# Altium schematic sheet encodeur_pale.SchDoc
size A4; SheetNumber: 4; SheetTotal: 11
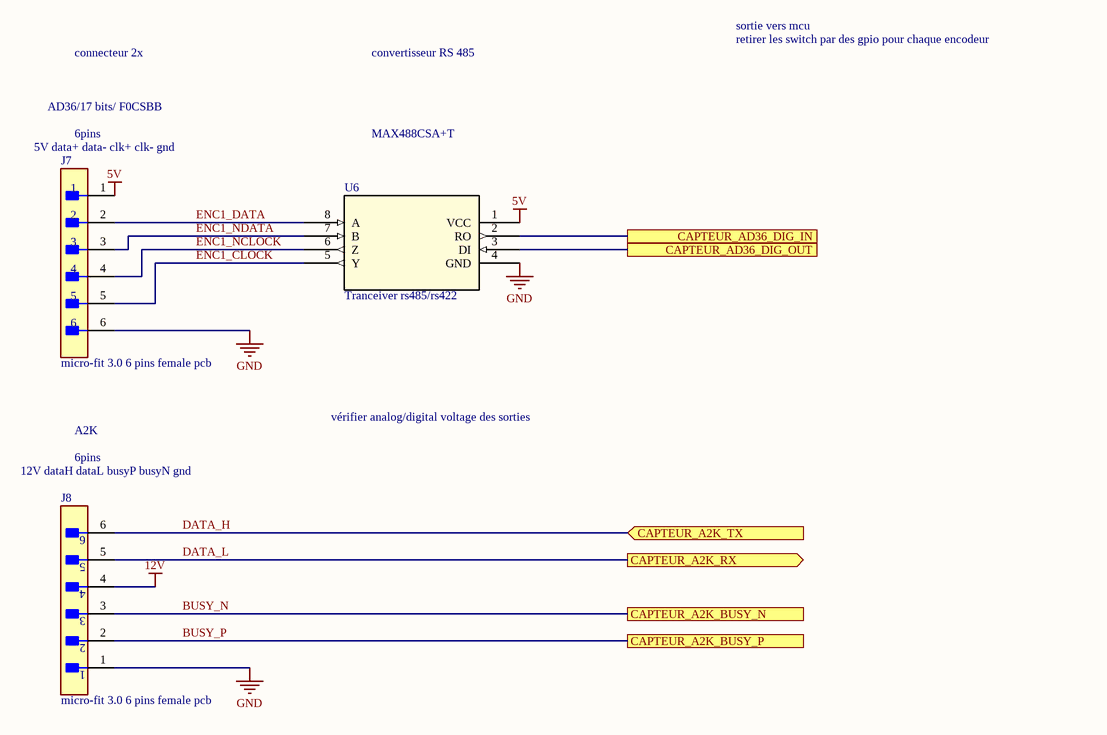
[diagram p0: encodeur_pale.SchDoc]

## Parts
J7  micro-fit 3.0 6 pins female pcb  [FP-0430450600-MFG]
J8  micro-fit 3.0 6 pins female pcb  [FP-0430450600-MFG]
U6  Tranceiver rs485/rs422  [21-0041_S8+2_MXM-M]

## Ports
CAPTEUR_A2K_BUSY_N, CAPTEUR_A2K_BUSY_P, CAPTEUR_A2K_RX (out), CAPTEUR_A2K_TX (in), CAPTEUR_AD36_DIG_IN, CAPTEUR_AD36_DIG_OUT

## Nets
5V: J7.1 U6.1(VCC)
12V: J8.4
GND: J7.6 J8.1 U6.4(GND)
BUSY_N: J8.3 ; port CAPTEUR_A2K_BUSY_N
BUSY_P: J8.2 ; port CAPTEUR_A2K_BUSY_P
CAPTEUR_AD36_DIG_IN: U6.2(RO) ; port CAPTEUR_AD36_DIG_IN
CAPTEUR_AD36_DIG_OUT: U6.3(DI) ; port CAPTEUR_AD36_DIG_OUT
DATA_H: J8.6 ; port CAPTEUR_A2K_TX
DATA_L: J8.5 ; port CAPTEUR_A2K_RX
ENC1_CLOCK: J7.5 U6.5(Y)
ENC1_DATA: J7.2 U6.8(A)
ENC1_NCLOCK: J7.4 U6.6(Z)
ENC1_NDATA: J7.3 U6.7(B)

## Notes on the sheet
- connecteur 2x
- convertisseur RS 485
- sortie vers mcu
- retirer les switch par des gpio pour chaque encodeur
- (near J7) 5V data+ data- clk+ clk- gnd
- AD36/17 bits/ F0CSBB
- 6pins
- MAX488CSA+T
- vérifier analog/digital voltage des sorties
- 12V dataH dataL busyP busyN gnd
- A2K

## Library data of the parts
J7 J8 = 430450600: Connector Wire to Board Header 6 Position 3mm Solder Right Angle Thru-Hole Tray; Manufacturer: Molex; Manufacturer Part Number: 43045-0600; Plating: 154ConductorMaterial; Contact Resistance: 10mR; Voltage Rating: 250V; Current Rating: 5A; Max Voltage Rating (DC): 250.25kV; Gender: Male; Number of Positions: 6; Insulation Resistance: 1GR; Approvals: UL,CSA,TUV; Glow Wire Compliant: 15Compliance; Supplier: Digikey; Supplier Part Number: WM1815-ND; RoHS: Yes; Category: Headers and Wire Housings; Stock: 3053; Pricing: 1=2.2, 10=1.875, 80=1.54863, 1728=1.18185, 5184=1.08404 (USD); Mounting Technology: Through Hole; Case/Package: SMC; Contact Material: Brass,Tin; Contact Plating: Tin; Housing Color: Black; Housing Material: Thermoplastic; Color: Black; Material: 4301ConductorMaterial; Min Operating Temperature: -40°C; Max Operating Temperature: 105°C; Number of Rows: 2; Packaging: Tray; Termination: Solder; Orientation: Right Angle; Package Quantity: 1728; Max Current Rating: 5A; Number of Circuits: 6; Number of Contacts: 6; Series: 43045; Voltage Rating (DC): 250V; Diameter: 3mm; Length: 13.15mm; Height: 8.77mm; Pitch: 3mm; Depth: 12.2mm; Row Spacing: 3mm; Radiation Hardening: No; Flammability Rating: UL94 V-0; RoHS Compliant: Yes; Reach SVHC Compliant: Unknown; Halogen Free: 5696HalogenFree; Lead Free: 5697LeadFree; Parameter 1: *
U6 = MAX488CSA+T: MAX488 Series 0.25 Mbps 12 V Full Duplex SMT RS 485 Transceiver - SOIC-8; Manufacturer: Maxim; Number of Receivers: 1; Operating Supply Voltage: 5V; Logic Function: Transceiver,Receiver; Data Rate: 250Kbps; Supply Current: 250uA; Supplier: Digikey; Supplier Part Number: MAX488CSA+TCT-ND; Manufacturer Part Number: MAX488CSA+T; RoHS: Yes; Category: Buffers, Drivers and Transceivers; Stock: 8351; Pricing: 1=4.22, 10=3.788, 25=3.5808, 100=3.1034, 250=2.9442, 500=2.64184, 1000=2.22805 (USD); Mounting Technology: Surface Mount; Case/Package: SOIC; Min Operating Temperature: 0°C; Max Operating Temperature: 70°C; Packaging: Tape and Reel; Number of Transmitters: 1; Number of Drivers: 1; Number of Transceivers: 1; Series: -; Package Quantity: 2500; Radiation Hardening: No; Lead Free: Lead Free; RoHS Compliant: Yes; ComponentLink1URL: https://datasheet.ciiva.com/14430/max1487-max491-14430333.pdf?src-supplier=Avnet; ComponentLink1Description: https://datasheet.ciiva.com/14430/max1487-max491-14430333.pdf?src-supplier=Avnet; ComponentLink2URL: https://datasheet.ciiva.com/14430/max1487-max491-14430886.pdf?src-supplier=Avnet; ComponentLink2Description: https://datasheet.ciiva.com/14430/max1487-max491-14430886.pdf?src-supplier=Avnet; ComponentLink3URL: https://datasheet.ciiva.com/1774/max1487-max491-1774524.pdf?src-supplier=Digikey; ComponentLink3Description: https://datasheet.ciiva.com/1774/max1487-max491-1774524.pdf?src-supplier=Digikey